# EAGLE design Adafruit Pixel Trinkey (EAGLE 9.6.2)
AUTHOR: ladyada
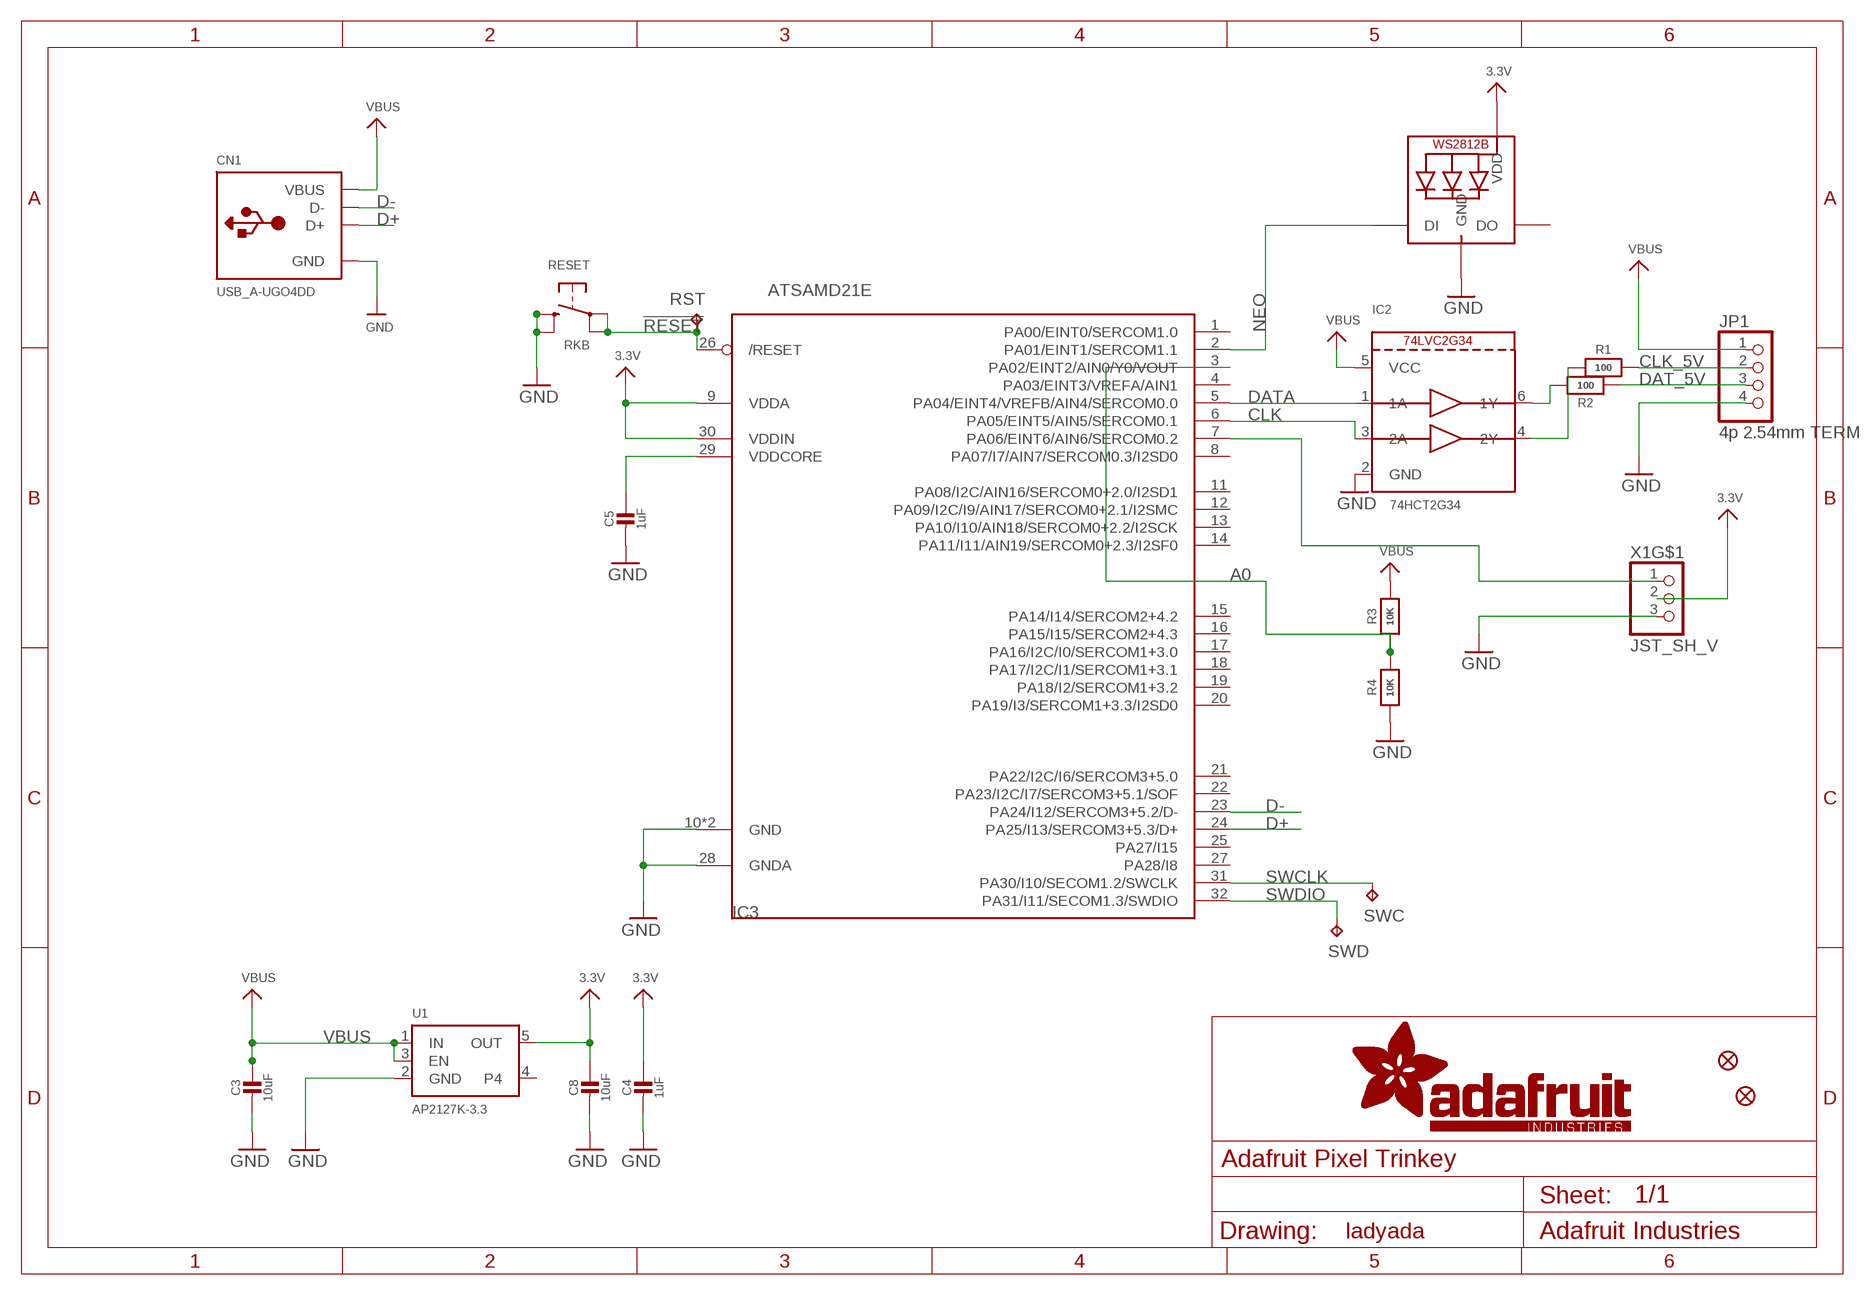
[diagram p0: schematic, sheet 1]

## Parts
C3  10uF  CAP_CERAMIC0805-NOOUTLINE  [0805-NO]
C4  1uF  CAP_CERAMIC0603_NO  [0603-NO]
C5  1uF  CAP_CERAMIC0603_NO  [0603-NO]
C8  10uF  CAP_CERAMIC0805-NOOUTLINE  [0805-NO]
CN1  USB_A-UGO4DD  USB_TYPEA_UG04DD  [USB_A-UGO4DD]
FID1  FIDUCIAL_0.5MM  [FIDUCIAL_0.5MM]
FID2  FIDUCIAL_0.5MM  [FIDUCIAL_0.5MM]
IC2  74HCT2G34  74LVC2G34  [SC70-6L]
IC3  ATSAMD21E  [QFN32_5MM]
JP1  4p 2.54mm TERM  HEADER-1X4_254MMTERM  [1X04_2.54MMTERMINAL]
LED1  WS2812B_SK6805_1515  [SK6805_1515]
R1  100  RESISTOR_0402NO  [_0402NO]
R2  100  RESISTOR_0402NO  [_0402NO]
R3  10K  RESISTOR_0402NO  [_0402NO]
R4  10K  RESISTOR_0402NO  [_0402NO]
RESET  RKB  SWITCH_TACT_SMT_RKB2  [BTN_RKB2_4.6X2.8]
RST  TPTP16R  [TP16R]
SWC  TPTP15R  [TP15R]
SWD  TPTP16R  [TP16R]
U1  AP2127K-3.3  VREG_SOT23-5  [SOT23-5]
X1  JST_SH_V  CON_JST_SH_3PINVERT  [JST_SH3_RA]

## Nets
3.3V: C4.1 C8.1 IC3.9(VDDA) IC3.30(VDDIN) LED1.2(VDD) U1.5(OUT) X1.2
!RESET: IC3.26(/RESET) RESET.A'(P1) RESET.A(P) RST.TP
A0: IC3.3(PA02/EINT2/AIN0/Y0/VOUT) R3.1 R4.2
CLK: IC2.3(2A) IC3.6(PA05/EINT5/AIN5/SERCOM0.1)
CLK_5V: JP1.2 R1.2
D+: CN1.D+ IC3.24(PA25/I13/SERCOM3+5.3/D+)
D-: CN1.D- IC3.23(PA24/I12/SERCOM3+5.2/D-)
DAT_5V: JP1.3 R2.2
DATA: IC2.1(1A) IC3.5(PA04/EINT4/VREFB/AIN4/SERCOM0.0)
GND: C3.2 C4.2 C5.2 C8.2 CN1.GND IC2.2(GND) IC3.10(GND) IC3.28(GNDA) IC3.33(GND) JP1.4 LED1.4(GND) R4.1 RESET.B'(S1) RESET.B(S) U1.2(GND) X1.3
N$1: IC3.7(PA06/EINT6/AIN6/SERCOM0.2) X1.1
N$2: IC2.4(2Y) R1.1
N$5: IC2.6(1Y) R2.1
NEO: IC3.2(PA01/EINT1/SERCOM1.1) LED1.1(DI)
SWCLK: IC3.31(PA30/I10/SECOM1.2/SWCLK) SWC.TP
SWDIO: IC3.32(PA31/I11/SECOM1.3/SWDIO) SWD.TP
VBUS: C3.1 CN1.VBUS IC2.5(VCC) JP1.1 R3.2 U1.1(IN) U1.3(EN)
VDDCORE1: C5.1 IC3.29(VDDCORE)
Unconnected: IC3.1(PA00/EINT0/SERCOM1.0) IC3.4(PA03/EINT3/VREFA/AIN1) IC3.8(PA07/I7/AIN7/SERCOM0.3/I2SD0) IC3.11(PA08/I2C/AIN16/SERCOM0+2.0/I2SD1) IC3.12(PA09/I2C/I9/AIN17/SERCOM0+2.1/I2SMC) IC3.13(PA10/I10/AIN18/SERCOM0+2.2/I2SCK) IC3.14(PA11/I11/AIN19/SERCOM0+2.3/I2SF0) IC3.15(PA14/I14/SERCOM2+4.2) IC3.16(PA15/I15/SERCOM2+4.3) IC3.17(PA16/I2C/I0/SERCOM1+3.0) IC3.18(PA17/I2C/I1/SERCOM1+3.1) IC3.19(PA18/I2/SERCOM1+3.2) IC3.20(PA19/I3/SERCOM1+3.3/I2SD0) IC3.21(PA22/I2C/I6/SERCOM3+5.0) IC3.22(PA23/I2C/I7/SERCOM3+5.1/SOF) IC3.25(PA27/I15) IC3.27(PA28/I8) LED1.3(DO) U1.4 X1.MT1(MT) X1.MT2(MT)

## Library data of the parts
C3-C5 C8 = microbuilder:CAP_CERAMIC: Ceramic Capacitors For new designs, use the packages preceded by an '_' character since they are more reliable: The following footprints should be used on most boards: _0402 - Standard footprint for regular board layouts _0603 - Standard footprint for regular board layouts _0805 - Standard footprint for regular board layouts _1206 - Standard footprint for regular board layouts For extremely tight-pitch boards where space is at a premium, the following 'micro-pitch' footprints can be used (smaller pads, no silkscreen outline, etc.): _0402MP - Micro-pitch footprint for very dense/compact boards _0603MP - Micro-pitch footprint for very dense/compact boards _0805MP - Micro-pitch footprint for very dense/compact boards _1206MP - Micro-pitch footprint for very dense/compact boards
CN1 = adafruit_electromech:USB_TYPEA: USB - Type A Connectors Male types stick out and are inserted into a PC or matching females parts (these are the connectors used on USB Memory Sticks, etc.). Female parts are generally used for USB Host and accept a male-type connector. SMT - 4UCON: 10017 PTHFML - Digikey: 609-1045-ND, 4UCon: 05241 PCB - Use 2.0mm thick PCBs with this footprint
FID1 FID2 = microbuilder:FIDUCIAL: Fiducial Alignment Points Various fiducial points for machine vision alignment.
IC2 = microbuilder:74LVC2G34
IC3 = adafruit_micro:ATSAMD21E; ROT: 270
JP1 = microbuilder:HEADER-1X4: PIN HEADER
LED1 = microbuilder:WS2812B; LCSC: C2890035
R1-R4 = microbuilder:RESISTOR: Resistors For new designs, use the packages preceded by an '_' character since they are more reliable: The following footprints should be used on most boards: _0402 - Standard footprint for regular board layouts _0603 - Standard footprint for regular board layouts _0805 - Standard footprint for regular board layouts _1206 - Standard footprint for regular board layouts For extremely tight-pitch boards where space is at a premium, the following 'micro-pitch' footprints can be used (smaller pads, no silkscreen outline, etc.): _0402MP - Micro-pitch footprint for very dense/compact boards _0603MP - Micro-pitch footprint for very dense/compact boards _0805MP - Micro-pitch footprint for very dense/compact boards _1206MP - Micro-pitch footprint for very dense/compact boards
RESET = adafruit_electromech:SWITCH_TACT_SMT: SMT Tact Switches RKB2 https://www.digikey.com/short/m027prz5
RST SWC SWD = testpad:TP: Test pad
U1 = adafruit_power:VREG_SOT23-5: SOT23-5 Fixed Voltage Regulators Part Current Out V Out V In V Dropout θJA (°C/W) TJ (°C) Digikey Part No. ADP121 150mA 3.3V 3.4-5.5V 0.09V @ 150mA -- -- ADP121-AUJZ33R7CT-ND ADP121 150mA 3.0V 3.1-5.5V 0.09V @ 150mA -- -- ADP121-AUJZ30R7CT-ND ADP122 300mA 3.3V 3.4-5.5V 0.085V @ 300mA -- -- ADP122AUJZ-3.3-R7CT-ND ADP1712 300mA 3.3V 3.5-5.5V 0.17V @ 300mA -- -- ADP1712AUJZ-3.3-R7TR-ND AP7311 (Low Cost) 150mA 3.3V 3.5-6V 0.15V @ 150mA -- -- AP7311-33WG-7DICT-ND LD39015M18R 150mA 1.8V 1.9V-5.5V 0.08V @ 100mA -- -- 497-6977-1-ND LP2985A-33DBVR 150mA 3.3V 3.3-16V 0.28V @ 150mA 206 150 296-18479-1-ND MCP1824T-3302E/OT 300mA 3.3V 3.5V-6V 0.2V @ 300mA -- -- MCP1824T-3302E/OTCT-ND MIC5205-2.5YM5 TR 150mA 2.5V 2.7-16V 0.165V @ 150mA -- -- 576-1257-2-ND MIC5205-3.0YM5 TR 150mA 3.0V 3.2V-16V 0.165V @ 150mA -- -- 576-1258-2-ND MIC5205-3.3YM5 TR 150mA 3.3V 3.5V-16V 0.165V @ 150mA -- -- 576-1259-2-ND TPS780330220 150mA 3.3V+2.2V 3.6-5.5V 250mV Max -- -- 296-23332-1-ND TDA3663/N1,135 100mA 3.3V 3.5-45V 0.18V @ 50mA -- -- 568-5343-1-ND Max operating temp can be calculated using θJA, TJ (max junction temperature), and power in watts. Set the "Maximum Ambient Temperature" until it reaches TJ ("Max Junction Temperature"), which is the absolute limit for safe use of the regulator: Heat Sink Temperature Calculator <http://www.daycounter.com/Calculators/Heat-Sink-Temperature-Calculator.phtml> For example, With 12V source into a 3.3V LP2985 and a 30mA load, we are dissipating (12V-3.3V) * 0.03A = 0.261W. With a θJA of 206 °C/W, a TJ of 150°C, and 261mW we can safely use the chip without a heat sink up to 75°C (=147.1°C Junction Temperature).; JLC_ROTATION: 0
X1 = adafruit_electromech:CON_JST_SH_3PIN

## Board
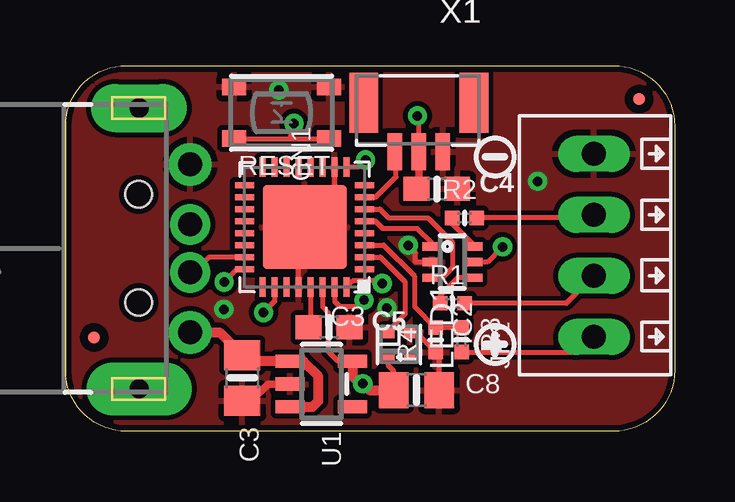
[diagram p1: board, top side]
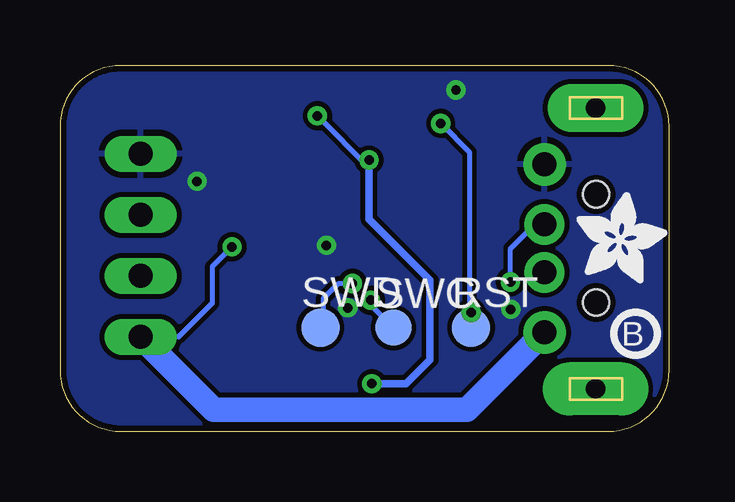
[diagram p2: board, bottom side, seen from below]

Size 25.4 x 15.24 mm. Coordinates in mm from the lower left corner, seen from the top.
Outline: 2.54,15.24 22.86,15.24 arc-90 25.4,12.7 25.4,2.54 arc-90 22.86,0 2.54,0 arc-90 0,2.54 0,12.7 arc-90 2.54,15.24
Copper layers (1*16): Top 0.035mm / dielectric 1.5mm / Bottom 0.035mm
Design rules "adafruit 7-7": minimum track width 6mil, minimum drill 15.5mil, track to track 8mil, track to pad 7mil, pad to pad 7mil, via to via 7mil, smd to smd 7mil, copper to edge 10mil, drill to drill 8mil, minimum pad ring 10mil, minimum via ring 8mil, stop-mask expansion 2mil, vias tented up to drill 20mil, thermal gap 10mil

### Footprints (pad centres in the part's own frame; a part is rotated, then mirrored left to right if it is on the bottom)
0805-NO = smd 1.24 x 1.5: 1 -0.95,0; 2 0.95,0
0603-NO = smd 1.075 x 1: 1 -0.85,0; 2 0.85,0
USB_A-UGO4DD = drill 1 pad 1.676: D+ -1,2.15; D- 1,2.15 | drill 1 pad 1.778: GND -3.5,2.15; VBUS 3.5,2.15 | drill 0.8 pad 2.2 long: MNT1 5.85,0.02 | drill 0.8 pad 2 long: MNT2 -5.85,0.02 | hole 1.1: 2.25,0; -2.25,0
FIDUCIAL_0.5MM = smd 0.5 x 0.5: 1 0,0
SC70-6L = smd 0.35 x 0.8: 1 -0.65,-0.85; 2 0,-0.85; 3 0.65,-0.85; 4 0.65,0.85; 5 0,0.85; 6 -0.65,0.85
QFN32_5MM = smd 0.8 x 0.25: 1 -2.5,1.75; 2 -2.5,1.25; 3 -2.5,0.75; 4 -2.5,0.25; 5 -2.5,-0.25; 6 -2.5,-0.75; 7 -2.5,-1.25; 8 -2.5,-1.75; 17 2.5,-1.75; 18 2.5,-1.25; 19 2.5,-0.75; 20 2.5,-0.25; 21 2.5,0.25; 22 2.5,0.75; 23 2.5,1.25; 24 2.5,1.75 | smd 0.25 x 0.8: 9 -1.75,-2.5; 10 -1.25,-2.5; 11 -0.75,-2.5; 12 -0.25,-2.5; 13 0.25,-2.5; 14 0.75,-2.5; 15 1.25,-2.5; 16 1.75,-2.5; 25 1.75,2.5; 26 1.25,2.5; 27 0.75,2.5; 28 0.25,2.5; 29 -0.25,2.5; 30 -0.75,2.5; 31 -1.25,2.5; 32 -1.75,2.5 | smd 3.5 x 3.5: 33 0,0
1X04_2.54MMTERMINAL = drill 1 long: 1 -3.81,0; 2 -1.27,0; 3 1.27,0; 4 3.81,0
SK6805_1515 = smd 0.5 x 0.5: 1 -0.5,-0.45; 2 0.5,-0.45; 3 0.5,0.45; 4 -0.5,0.45
_0402NO = smd 0.6 x 0.6: 1 -0.508,0; 2 0.508,0
BTN_RKB2_4.6X2.8 = smd 1 x 0.7: A 1.973,1.075; A' -1.973,1.075; B 1.973,-1.075; B' -1.973,-1.075
TP16R = smd 1.6 x 1.6: TP 0,0
TP15R = smd 1.5 x 1.5: TP 0,0
SOT23-5 = smd 0.55 x 1.2: 1 -0.95,-1.3; 2 0,-1.3; 3 0.95,-1.3; 4 0.95,1.3; 5 -0.95,1.3
JST_SH3_RA = smd 0.6 x 1.55: 1 1,0.924; 2 0,0.924; 3 -1,0.924 | smd 1.2 x 2.5: MT1 -2.3,-1.124; MT2 2.3,-1.124

### Placement (x,y rotation side)
C3  7.37,2.22 270 top
C4  15.48,10.1 0 top
C5  10.99,4.33 0 top
C8  14.63,1.71 0 top
CN1  3.05,7.62 270 top
FID1  23.91,13.84 0 top
FID2  1.19,3.91 0 top
IC2  16.13,7.05 270 top
IC3  9.97,8.51 180 top
JP1  22.03,7.75 90 top
LED1  13.91,3.62 270 top
PLABEL0  [PLABEL0]  17.08,0.7 0 top
PLABEL1  [PLABEL1]  18.16,9.14 0 top
PLABEL2  [PLABEL2]  18.16,6.41 0 top
PLABEL3  [PLABEL3]  17.84,13.46 0 top
PLABEL4  [PLABEL4]  6.35,11.87 90 top
PLABEL5  [PLABEL5]  20.32,8.95 0 bottom
PLABEL6  [PLABEL6]  20.38,6.41 0 bottom
PLABEL7  [PLABEL7]  20.45,4 0 bottom
PLABEL8  [PLABEL8]  20.45,11.62 0 bottom
PLABEL9  [PLABEL9]  15.88,12.19 90 bottom
PLABEL10  [PLABEL10]  14.73,12.19 90 bottom
PLABEL11  [PLABEL11]  13.72,12.19 90 bottom
PLABEL12  [PLABEL12]  24.64,8.19 90 bottom
PLABEL13  [PLABEL13]  10.35,8.83 0 bottom
PLABEL14  [PLABEL14]  14.86,1.21 0 bottom
R1  16.13,5.33 0 top
R2  16.64,8.89 0 top
R3  16.51,3.81 270 top
R4  15.43,3.81 90 top
RESET  9,13.27 180 top
RST  8.26,4.32 0 bottom
SWC  11.49,4.32 0 bottom
SWD  14.54,4.32 0 bottom
U1  10.67,1.97 270 top
U$8  [PCBFEAT-REV-040]  1.4,4.06 180 bottom
U$9  [SYMBOL_PLUS]  17.91,3.62 0 top
U$10  [SYMBOL_MINUS]  17.91,11.43 0 top
U$12  [ADAFRUIT_3.5MM]  3.87,6.16 0 bottom
X1  14.73,12.57 180 top

### Tracks (layer width: path | path; a pad name or v marks a point on that pad's centre or on a via)
3.3V  (via drill 0.39)
  Top 0.203: IC3.30 10.72,5.18 10.95,4.95 10.95,3.33 11.37,2.92 U1.5 | IC3.9 12.22,11.01 v12.51,11.3 | C8.1 13.68,2.51 13.46,2.74 LED1.2 | X1.2 14.73,13.08 v14.67,13.14
  Top 0.305: X1.2 14.73,10.2 C4.1
  Top 0.406: U1.5 11.97,2.28 12.27,1.98 v12.4,1.98 12.66,1.71 C8.1
  Bottom 0.203: v14.67,13.14 12.51,10.98
  Bottom 0.305: v12.51,11.3 12.51,10.98 12.51,8.83 9.97,6.29 9.97,2.98 10.97,1.98 v12.4,1.98
!RESET  (via drill 0.39)
  Top 0.203: IC3.26 8.72,5.42 v8.26,4.95 | RESET.A 9.4,12.2 | 9.4,12.2 RESET.A' | 9.4,12.2 9.4,12.7 v9.53,12.83
  Bottom 0.203: v8.26,4.95 RST.TP 8.32,4.38 8.32,11.62 v9.53,12.83
A0
  Top 0.203: R3.1 R4.2 14.57,5.18 14.57,6.46 13.26,7.76 IC3.3
CLK
  Top 0.203: IC3.6 13.1,9.26 13.49,8.88 15.12,8.88 16.13,7.87 16.13,6.8 15.72,6.4 IC2.3
CLK_5V
  Top 0.203: JP1.2 20.89,5.33 R1.2
D+  (via drill 0.39)
  Top 0.203: v6.61,6.22 7.15,6.76 IC3.24
  Bottom 0.203: v6.61,6.22 6.61,7.61 5.6,8.62 CN1.D+
D-
  Top 0.203: IC3.23 5.99,7.26 5.35,6.62 CN1.D-
DAT_5V
  Top 0.203: JP1.3 21.91,8.89 R2.2
DATA
  Top 0.203: IC2.1 15.28,7.83 14.66,8.44 13.23,8.44 12.91,8.76 IC3.5
GND  (via drill 0.39)
  Top 0.203: IC3.28 9.72,8.51 IC3.33 11.22,8.51 IC3.10 | LED1.4 14.61,4.12 R4.1 15.58,3.15 C8.2 | v14.29,7.75 14.6,7.44 14.6,7.05 IC2.2
  Top 0.305: U1.2 8.44,1.97 7.75,1.27 C3.2
  other vias: 8.89,14.22 6.6,5.08 19.68,10.41 13.4,5.14
  pour Top: 0,15.24 25.53,15.24 25.53,0 0,0
  pour Bottom: 0,15.24 25.53,15.24 25.53,0 0,0
N$1
  Top 0.203: IC3.7 12.93,9.76 13.78,10.61 13.78,11.6 X1.1
N$2
  Top 0.203: IC2.4 16.37,6.4 15.62,5.65 R1.1
N$5
  Top 0.203: R2.1 16.13,8.65 16.98,7.8 IC2.6
NEO
  Top 0.203: IC3.2 13.12,7.26 14.16,6.22 14.16,4.89 13.46,4.18 LED1.1
SWCLK  (via drill 0.39)
  Top 0.203: IC3.31 11.22,5.42 11.43,5.21 12.19,5.21 v12.45,5.46
  Bottom 0.203: v12.45,5.46 12.45,5.27 SWC.TP
SWDIO  (via drill 0.39)
  Top 0.203: IC3.32 11.97,6.26 13.1,6.26 v13.21,6.16
  Bottom 0.203: v13.21,6.16 13.78,6.16 14.42,5.52 14.42,4.44 SWD.TP
VBUS  (via drill 0.39)
  Top 0.203: v18.22,7.68 17.59,7.05 IC2.5 | R3.2 21.4,3.3 JP1.1
  Top 0.406: CN1.VBUS 6.42,4.12 C3.1 7.62,2.92 U1.1 9.91,2.92 10.54,2.29 10.54,1.27 10.29,1.02 U1.3
  Bottom 0.203: v18.22,7.68 19.05,6.86 19.05,5.33 20.45,3.94 JP1.1
  Bottom 1.016: CN1.VBUS 8.43,0.89 18.99,0.89 JP1.1
VDDCORE1
  Top 0.203: IC3.29 10.22,4.42 C5.1

### Text on the board
tValues: C1898
Pinguin_tBackup: Pixel | Reset | D | C | Trinkey
Pinguin_bBackup: D4 | 3.3V | GND | Gnd | Pixel / Trinkey | Data | 5V Logic Outputs | Clock | +5V | NeoPixel or DotStar LEDs